# Altium project ST25RU3993_RF_MODULE_REV_E.PrjPcb (part 2 of 4)

## Sheet UHF_RFID_HP.SchDoc
size B; SheetNumber: 4; SheetTotal: 12; PageSetup: Record=PageOptions|CenterHorizontal=True|CenterVertical=True|PrintScale=0.97|XCorrection=1.00|YCorrection=1.00|PrintKind=0|BorderSize=5000000|LeftOffset=0|BottomOffset=0|Orientation=2|PaperLength=1000|PaperWidth=1000|Scale=100|PaperSource=7|PrintQuality=-4|MediaType=1|DitherType=10|PaperKind=A4|PrintScaleMode=1
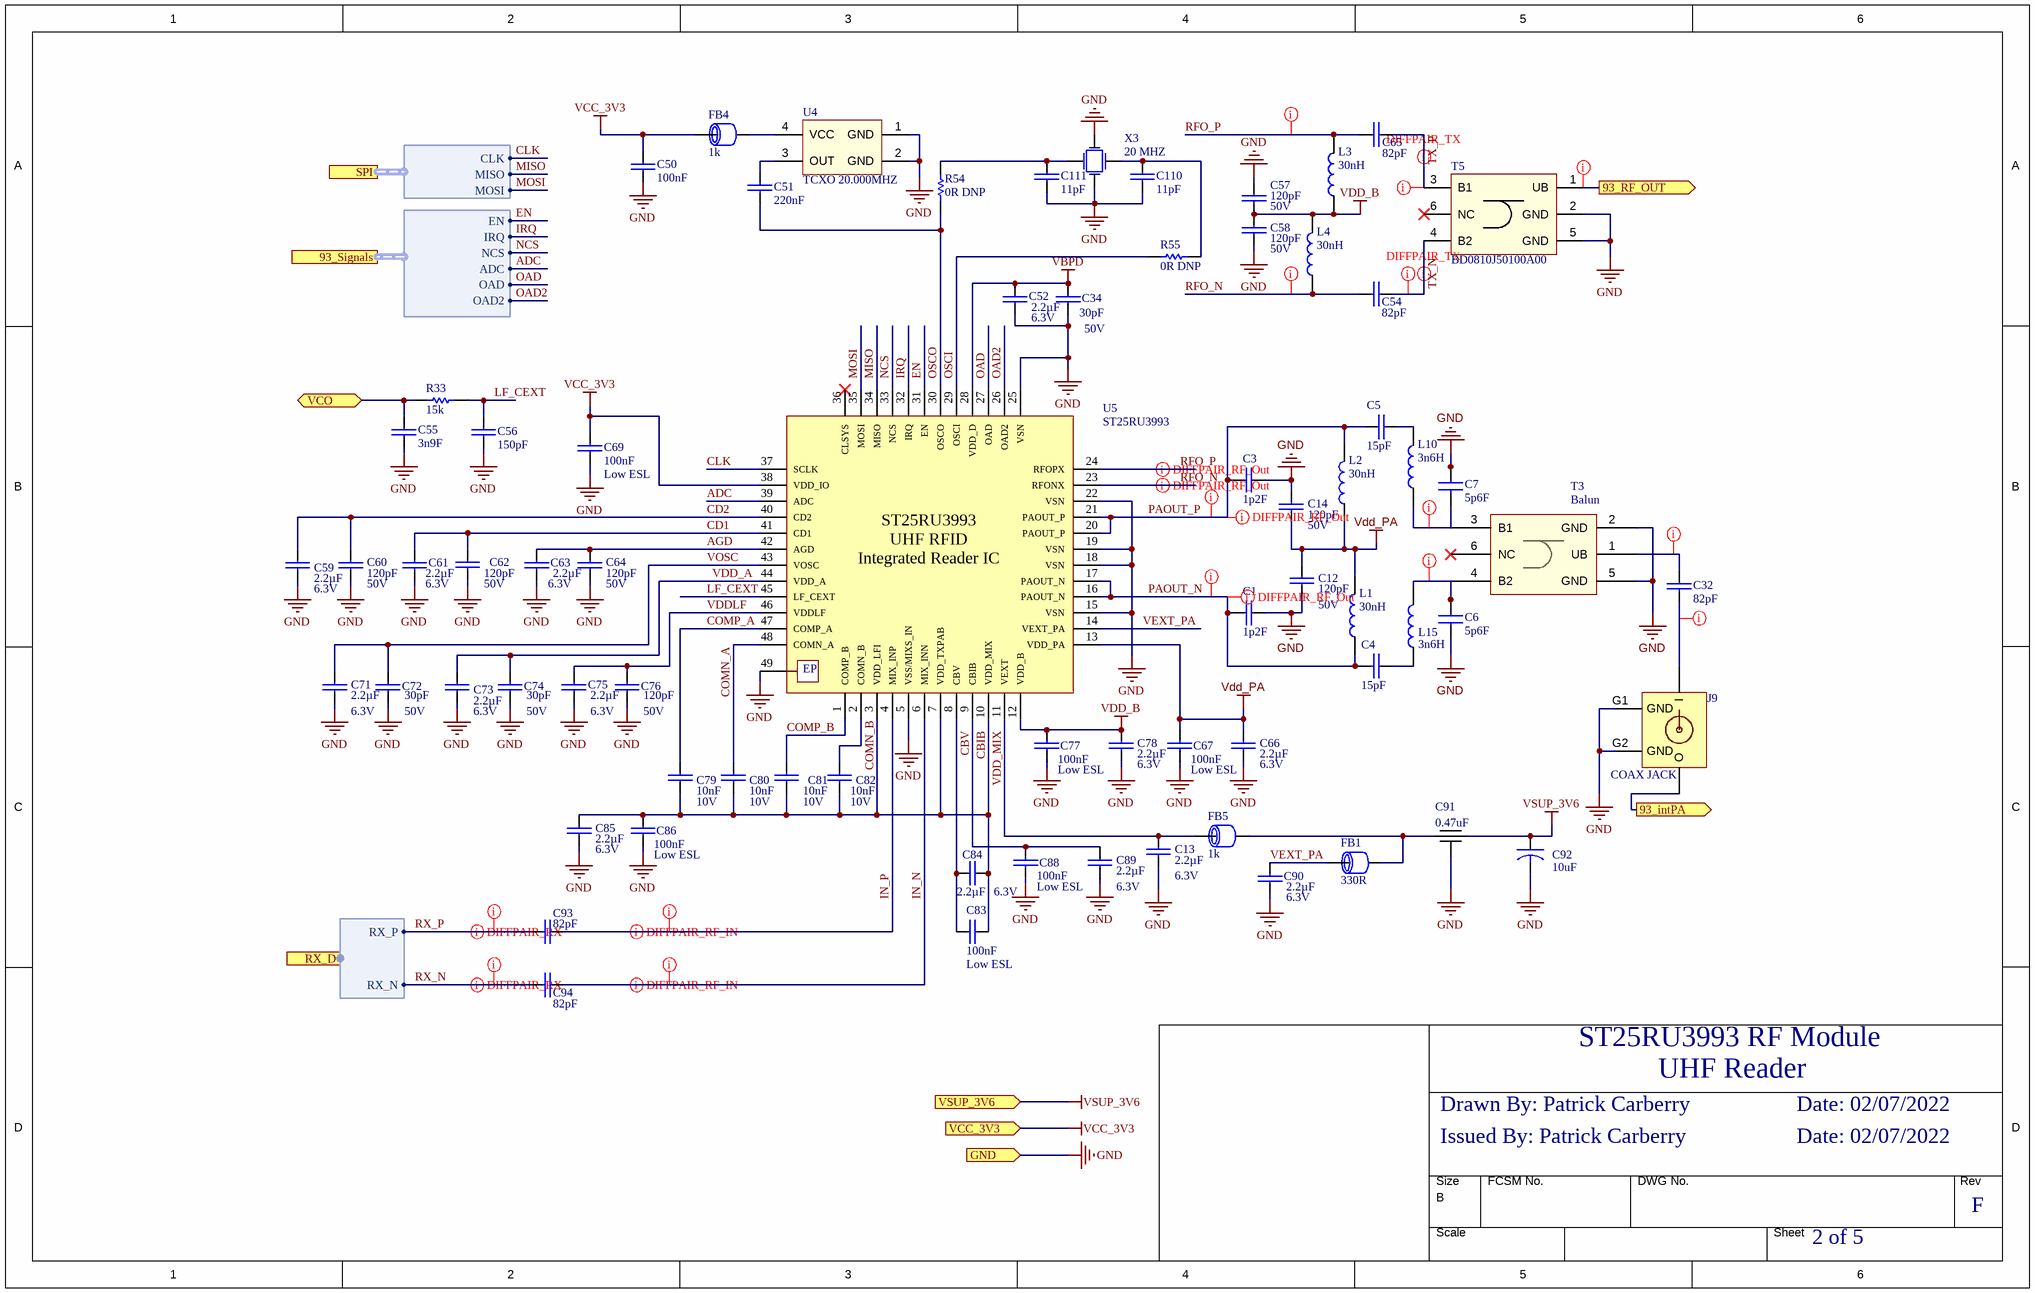
[diagram p1: UHF_RFID_HP.SchDoc]

### Parts
C1  1p2F  [C0402-RF]
C3  1p2F  [C0402-RF]
C4  15pF  [C0402-RF]
C5  15pF  [C0402-RF]
C6  5p6F  [C0402-RF]
C7  5p6F  [C0402-RF]
C12  value 120pF  Voltage: 50V  [C0402-RF]  (hidden comment: C0402C121J5GACAUTO)
C13  Capacitance: 2.2µF  Voltage - Rated: 6.3V  [C0402-RF]  (hidden comment: C0402C225K9PAC7867)
C14  value 120pF  Voltage: 50V  [C0402-RF]  (hidden comment: C0402C121J5GACAUTO)
C32  82pF  [C0402-RF]
C34  value 30pF  Voltage: 50V  [C0402-RF]  (hidden comment: GCM1555C1H300GA16D)
C50  100nF  [C0402-RF]
C51  220nF  [C0402-RF]
C52  Capacitance: 2.2µF  Voltage - Rated: 6.3V  [C0402-RF]  (hidden comment: C0402C225K9PAC7867)
C54  82pF  [C0402-RF]
C55  3n9F  [C0402-RF]
C56  150pF  [C0402-RF]
C57  value 120pF  Voltage: 50V  [C0402-RF]  (hidden comment: C0402C121J5GACAUTO)
C58  value 120pF  Voltage: 50V  [C0402-RF]  (hidden comment: C0402C121J5GACAUTO)
C59  Capacitance: 2.2µF  Voltage - Rated: 6.3V  [C0402-RF]  (hidden comment: C0402C225K9PAC7867)
C60  value 120pF  Voltage: 50V  [C0402-RF]  (hidden comment: C0402C121J5GACAUTO)
C61  Capacitance: 2.2µF  Voltage - Rated: 6.3V  [C0402-RF]  (hidden comment: C0402C225K9PAC7867)
C62  value 120pF  Voltage: 50V  [C0402-RF]  (hidden comment: C0402C121J5GACAUTO)
C63  Capacitance: 2.2µF  Voltage - Rated: 6.3V  [C0402-RF]  (hidden comment: C0402C225K9PAC7867)
C64  value 120pF  Voltage: 50V  [C0402-RF]  (hidden comment: C0402C121J5GACAUTO)
C65  82pF  [C0402-RF]
C66  Capacitance: 2.2µF  Voltage - Rated: 6.3V  [C0402-RF]  (hidden comment: C0402C225K9PAC7867)
C67  100nF  Features: Low ESL  [C0402-LLL]
C69  100nF  Features: Low ESL  [C0402-LLL]
C71  Capacitance: 2.2µF  Voltage - Rated: 6.3V  [C0402-RF]  (hidden comment: C0402C225K9PAC7867)
C72  value 30pF  Voltage: 50V  [C0402-RF]  (hidden comment: GCM1555C1H300GA16D)
C73  Capacitance: 2.2µF  Voltage - Rated: 6.3V  [C0402-RF]  (hidden comment: C0402C225K9PAC7867)
C74  value 30pF  Voltage: 50V  [C0402-RF]  (hidden comment: GCM1555C1H300GA16D)
C75  Capacitance: 2.2µF  Voltage - Rated: 6.3V  [C0402-RF]  (hidden comment: C0402C225K9PAC7867)
C76  value 120pF  Voltage: 50V  [C0402-RF]  (hidden comment: C0402C121J5GACAUTO)
C77  100nF  Features: Low ESL  [C0402-LLL]
C78  Capacitance: 2.2µF  Voltage - Rated: 6.3V  [C0402-RF]  (hidden comment: C0402C225K9PAC7867)
C79  value 10nF  Voltage - Rated: 10V  [C0402-RF]  (hidden comment: CGA2B2X5R1E103K050BA)
C80  value 10nF  Voltage - Rated: 10V  [C0402-RF]  (hidden comment: CGA2B2X5R1E103K050BA)
C81  value 10nF  Voltage - Rated: 10V  [C0402-RF]  (hidden comment: CGA2B2X5R1E103K050BA)
C82  value 10nF  Voltage - Rated: 10V  [C0402-RF]  (hidden comment: CGA2B2X5R1E103K050BA)
C83  100nF  Features: Low ESL  [C0402-LLL]
C84  Capacitance: 2.2µF  Voltage - Rated: 6.3V  [C0402-RF]  (hidden comment: C0402C225K9PAC7867)
C85  Capacitance: 2.2µF  Voltage - Rated: 6.3V  [C0402-RF]  (hidden comment: C0402C225K9PAC7867)
C86  100nF  Features: Low ESL  [C0402-LLL]
C88  100nF  Features: Low ESL  [C0402-LLL]
C89  Capacitance: 2.2µF  Voltage - Rated: 6.3V  [C0402-RF]  (hidden comment: C0402C225K9PAC7867)
C90  Capacitance: 2.2µF  Voltage - Rated: 6.3V  [C0402-RF]  (hidden comment: C0402C225K9PAC7867)
C91  0.47uF  [NFM18PS]
C92  10uF  [2917(7343)]
C93  82pF  [C0402-RF]
C94  82pF  [C0402-RF]
C110  11pF  [C0402-RF]
C111  11pF  [C0402-RF]
FB1  330R  [FB0402-RF]
FB4  1k  [L0402-RF]
FB5  1k  [L0402-RF]
J9  COAX JACK  [MS-156HF]
L1  30nH  [L0402-RF]
L2  30nH  [L0402-RF]
L3  30nH  [L0402-RF]
L4  30nH  [L0402-RF]
L10  3n6H  [L0402-RF]
L15  3n6H  [L0402-RF]
R33  15k  [R0402-RF]
R54  0R DNP  [R0402-RF]
R55  0R DNP  [R0402-RF]
T3  Balun  [JTI-0900BL15C050]
T5  BD0810J50100A00  [BD0810J50100AHF]
U4  TCXO 20.000MHZ  [3.2 x 2.5 mm SMD]
U5  ST25RU3993  [ST25RU3993_QFN48_0.5mm_pitch]
X3  20 MHZ  [NX3225SA]

### Ports
93_intPA (out), 93_RF_OUT (out), 93_Signals (harness Harness_93), GND (in), RX_D (harness Harness_RX_D), SPI (harness Harness_SPI), VCC_3V3 (in), VCO (bidir), VSUP_3V6 (in)

### Harnesses
Harness_RX_D: RX_P, RX_N
Harness_SPI: MISO, MOSI, CLK
Harness_93: IRQ, EN, NCS, ADC, OAD, OAD2

### Nets
GND: C1.2 C3.2 C6.2 C7.1 C12.2 C13.2 C14.1 C34.2 C50.2 C52.1 C55.2 C56.2 C57.1 C58.2 C59.2 C60.2 C61.2 C62.2 C63.2 C64.2 C66.2 C67.2 C69.2 C71.2 C72.2 C73.2 C74.2 C75.2 C76.2 C77.2 C78.2 C85.2 C86.2 C88.2 C89.2 C90.2 C91.2 C92.2 C110.2 C111.2 J9.G1(GND) J9.G2(GND) T3.2(GND) T3.5(GND) T5.2(GND) T5.5(GND) U4.1(GND) U4.2(GND) U5.5(VSS/MIXS_IN) U5.15(VSN) U5.18(VSN) U5.19(VSN) U5.22(VSN) U5.25(VSN) U5.49(EP) X3.2(GND) X3.4(GND) ; port GND
VBPD: C34.1 C52.2 U5.28(VDD_D)
VCC_3V3: C50.1 C69.1 FB4.1 U5.38(VDD_IO) ; port VCC_3V3
VDD_B: C57.2 C58.1 C77.1 C78.1 L3.1 L4.2 U5.12(VDD_B)
Vdd_PA: C12.1 C14.2 C66.1 C67.1 L1.2 L2.1 U5.13(VDD_PA)
VSUP_3V6: C91.3 C92.1 ; port VSUP_3V6
ADC: U5.39(ADC) ; port 93_Signals.ADC
AGD: C63.1 C64.1 U5.42(AGD)
CBIB: C88.1 C89.1 U5.9(CBIB)
CBV: C83.1 C84.1 U5.8(CBV)
CD1: C61.1 C62.1 U5.41(CD1)
CD2: C59.1 C60.1 U5.40(CD2)
CLK: U5.37(SCLK) ; port SPI.CLK
COMN_A: C80.1 U5.48(COMN_A)
COMN_B: C82.1 U5.2(COMN_B)
COMP_A: C79.1 U5.47(COMP_A)
COMP_B: C81.1 U5.1(COMP_B)
EN: U5.31(EN) ; port 93_Signals.EN
IN_N: C94.2 U5.6(MIX_INN)
IN_P: C93.2 U5.4(MIX_INP)
IRQ: U5.32(IRQ) ; port 93_Signals.IRQ
LF_CEXT: C56.1 R33.2 U5.45(LF_CEXT)
MISO: U5.34(MISO) ; port SPI.MISO
MOSI: U5.35(MOSI) ; port SPI.MOSI
NCS: U5.33(NCS) ; port 93_Signals.NCS
OAD: U5.27(OAD) ; port 93_Signals.OAD
OAD2: U5.26(OAD2) ; port 93_Signals.OAD2
OSCI: R55.2 U5.29(OSCI)
OSCO: C51.2 R54.1 U5.30(OSCO)
PAOUT_N: C1.1 C4.1 L1.1 U5.16(PAOUT_N) U5.17(PAOUT_N)
PAOUT_P: C3.1 C5.1 L2.2 U5.20(PAOUT_P) U5.21(PAOUT_P)
RFO_N: C54.1 L4.1 U5.23(RFONX)
RFO_P: C65.1 L3.2 U5.24(RFOPX)
RX_N: C94.1 ; port RX_D.RX_N
RX_P: C93.1 ; port RX_D.RX_P
TX_N: C54.2 T5.4(B2)
TX_P: C65.2 T5.3(B1)
VCO: C55.1 R33.1 ; port VCO
VDD_A: C73.1 C74.1 U5.44(VDD_A)
VDD_MIX: C79.2 C80.2 C81.2 C82.2 C83.2 C84.2 C85.1 C86.1 U5.3(VDD_LFI) U5.7(VDD_TXPAB) U5.10(VDD_MIX)
VDDLF: C75.1 C76.1 U5.46(VDDLF)
VEXT_PA: C90.1 FB1.1 U5.14(VEXT_PA)
VOSC: C71.1 C72.1 U5.43(VOSC)
NetC4_2: C4.2 L15.1
NetC5_2: C5.2 L10.2
NetC6_1: C6.1 L15.2 T3.4(B2)
NetC7_2: C7.2 L10.1 T3.3(B1)
NetC13_1: C13.1 FB5.1 U5.11(VEXT)
NetC32_1: C32.1 J9.IN(I)
NetC32_2: C32.2 T3.1(UB)
NetC51_1: C51.1 U4.3(OUT)
NetC91_1: C91.1 FB1.2 FB5.2
NetC107_1: J9.OUT(O) ; port 93_intPA
NetC110_1: C110.1 R55.1 X3.3
NetC111_1: C111.1 R54.2 X3.1
NetFB4_2: FB4.2 U4.4(VCC)
NetJ1_IN: T5.1(UB) ; port 93_RF_OUT

Not connected (* = marked no-connect by the designer): T3 6(NC)*; T5 6(NC)*; U5 36(CLSYS)*

### Layout directives
net class SE_CPWG: NetC32_1, NetC32_2, NetJ1_IN
differential pair: IN_N, IN_P, PAOUT_N, PAOUT_P, RFO_N, RFO_P, RX_N, RX_P, TX_N, TX_P
net class Differential_RF: IN_N, IN_P, RFO_N, RFO_P, RX_N, RX_P, TX_N, TX_P
net class PAOUT: NetC6_1, NetC7_2, PAOUT_N, PAOUT_P

### Notes on the sheet
- Drawn By: Patrick Carberry
- ST25RU3993 RF Module
- UHF Reader
- Date: 02/07/2022
- Issued By: Patrick Carberry
- 2 of 5
- F
- (in symbol ST25RU3993) ST25RU3993 / UHF RFID / Integrated Reader IC

### Library data of the parts
C1 C3 = GRM1555C1H1R2WA01D: CAP CER 1.2PF 50V NP0 0402; Manufacturer: Murata Electronics North America; Tolerance: ±0.05pF; Temperature Coefficient: C0G, NP0; Exact Component Match: yes; Supplier 1: Digi-Key; Supplier Part Number 1: 490-6210-1-ND; Manufacturer Part Number: GRM1555C1H1R2WA01D; RoHS: RoHS Compliant; Category: Capacitors; Stock 1: 22733; Pricing 1: 1=0.1, 10=0.036, 50=0.02, 100=0.0169, 250=0.01384, 500=0.01182, 1000=0.00921, 5000=0.00768 (EUR); Packaging: Cut Tape (CT); Part Status: Active; Capacitance: 1.2pF; Voltage - Rated: 50V; Operating Temperature: -55°C ~ 125°C; Features: -; Ratings: -; Applications: General Purpose; Mounting Type: Surface Mount, MLCC; Package / Case: 0402 (1005 Metric); Size / Dimension: 0.039" L x 0.020" W (1.00mm x 0.50mm); Height - Seated (Max): -; Thickness (Max): 0.022" (0.55mm); Lead Spacing: -; Lead Style: -; ComponentLink1URL: http://www.murata.com/~/media/webrenewal/support/library/catalog/products/capacitor/mlcc/c02e.pdf; ComponentLink1Description: http://www.murata.com/~/media/webrenewal/support/library/catalog/products/capacitor/mlcc/c02e.pdf
C4 C5 = GRM1555C1H150GA01D: CAP CER 15PF 50V NP0 0402; Manufacturer: Murata Electronics North America; Tolerance: ±2%; Temperature Coefficient: C0G, NP0; Exact Component Match: yes; Supplier 1: Digi-Key; Supplier Part Number 1: 490-6201-1-ND; Manufacturer Part Number: GRM1555C1H150GA01D; RoHS: RoHS Compliant; Category: Capacitors; Stock 1: 104870; Pricing 1: 1=0.1, 10=0.021, 50=0.0114, 100=0.0095, 250=0.0078, 500=0.00666, 1000=0.00518, 5000=0.00432 (EUR); Packaging: Cut Tape (CT); Part Status: Active; Capacitance: 15pF; Voltage - Rated: 50V; Operating Temperature: -55°C ~ 125°C; Features: -; Ratings: -; Applications: General Purpose; Mounting Type: Surface Mount, MLCC; Package / Case: 0402 (1005 Metric); Size / Dimension: 0.039" L x 0.020" W (1.00mm x 0.50mm); Height - Seated (Max): -; Thickness (Max): 0.022" (0.55mm); Lead Spacing: -; Lead Style: -; ComponentLink1URL: http://www.murata.com/~/media/webrenewal/support/library/catalog/products/capacitor/mlcc/c02e.pdf; ComponentLink1Description: http://www.murata.com/~/media/webrenewal/support/library/catalog/products/capacitor/mlcc/c02e.pdf
C6 C7 = GJM1555C1H5R6CB01D: CAP CER 5.6PF 50V NP0 0402; Manufacturer 1: Murata Electronics North America; Tolerance: ±0.25pF; Temperature Coefficient: C0G, NP0; Frequency Min: 380; Frequency Max: 960; Gain: 32; RF IC Case Style: QFN; No. of Pins: 16; Supply Voltage Min: 3; Supply Voltage Max: 5; Frequency Range: 380MHz to 960; RF Type: General Purpose; Supply Current: 320; Supply Voltage Range: 3V to 5V<!--FANDB--><div class="features-and-benefits-container"><div class="features-and-benefits-description"><span class="features-benefits-value">The RFPA0133 is a 3 to 5V high efficiency programmable gain Power Amplifier designed to offer saturated efficiency greater than 60% over a range of frequencies from 380 to 960MHz. The device is manufactured on an advanced Gallium Arsenide Heterojunction Bipolar Transistor (HBT) process.</span></div><div class="features-and-benefits-list"><ul class="features-and-benefits-list-list"><li class="features-and-benefits-list-item">0.5W CW Output power at 3.6V</li><li class="features-and-benefits-list-item">1W CW Output power at 5V</li><li class="features-and-benefits-list-item">32dB Small signal gain at 900; Exact Component Match: yes; Supplier 1: Digi-Key; Supplier Part Number 1: 490-3103-1-ND; Manufacturer Part Number 1: GJM1555C1H5R6CB01D; RoHS: RoHS Compliant; Category: Capacitors; Stock 1: 38361; Pricing 1: 1=0.09, 10=0.054, 50=0.0294, 100=0.0248, 250=0.02028, 500=0.01734, 1000=0.0135, 5000=0.01125 (EUR); Packaging: Cut Tape (CT); Part Status: Active; Capacitance: 5.6pF; Voltage - Rated: 50V; Operating Temperature: -55°C ~ 125°C; Features: High Q, Low Loss; Ratings: -; Applications: RF, Microwave, High Frequency; Failure Rate: *; Mounting Type: Surface Mount, MLCC; Package / Case: 0402 (1005 Metric); Size / Dimension: 0.039" L x 0.020" W (1.00mm x 0.50mm); Height - Seated (Max): -; Thickness (Max): 0.022" (0.55mm); Lead Spacing: -; Lead Style: -; ComponentLink1URL: http://www.murata.com/~/media/webrenewal/support/library/catalog/products/capacitor/mlcc/c02e.pdf; ComponentLink1Description: http://www.murata.com/~/media/webrenewal/support/library/catalog/products/capacitor/mlcc/c02e.pdf; Supplier 2: Farnell; Supplier Part Number 2: 2066376; Manufacturer 2: RFMD; Manufacturer Part Number 2: RFPA0133; Stock 2: 0; Pricing 2: 1=26.04, 10=22.77, 100=18.87, 200=16.98, 500=15.29, 1000=12.85, 2000=11.58 (GBP); Noise Figure Typ: -; Operating Temperature Min: -40; Operating Temperature Max: 85; Product Range: -; Automotive Qualification Standard: -; MSL: MSL 3 - 168 hours; Operating Temperature Range: -40°C to +85; ComponentLink2URL: http://www.farnell.com/datasheets/1848789.pdf; ComponentLink2Description: http://www.farnell.com/datasheets/1848789.pdf; ComponentLink3URL: http://www.farnell.com/datasheets/2042598.pdf; ComponentLink3Description: http://www.farnell.com/datasheets/2042598.pdf; Manufacturer: Murata Electronics North America; Manufacturer Part Number: GJM1555C1H5R6CB01D
C12 C14 C57 C58 C60 C62 C64 C76 = CAP_120PF_50V_5%_C0G_0402: CAP CER 120PF 50V C0G/NP0 0402; Manufacturer: KEMET; Manufacturer Part Number: C0402C121J5GACAUTO; ComponentLink1URL: https://content.kemet.com/datasheets/KEM_C1022_C0G_AUTO_SMD.pdf; ComponentLink1Description: http://search.murata.co.jp/Ceramy/image/img/A01X/G101/ENG/GRM0335C1H121JA01-01.pdf
C13 C52 C59 C61 C63 C66 C71 C73 C75 C78 C84 C85 C89 C90 = CAP_2.2UF_6.3V_10%_X5R_0402: Manufacturer: KEMET; Tolerance: 10%; Temperature Coefficient: X5R; Thickness (Max): 0.014" (0.35mm); ComponentLink1URL: https://connect.kemet.com:7667/gateway/IntelliData-ComponentDocumentation/1.0/download/datasheet/C0402C225K9PACTU; ComponentLink1Description: http://www.murata.com/~/media/webrenewal/support/library/catalog/products/capacitor/mlcc/c02e.pdf; Manufacturer Part Number: C0402C225K9PAC7867
C32 C54 C65 C93 C94 = GRM1555C1H820GA01J: CAP CER 82PF 50V C0G/NP0 0402; Manufacturer: Murata Electronics North America; Tolerance: ±2%; Temperature Coefficient: C0G, NP0; Filter Type: Signal Line; Number of Lines: 1; Impedance @ Frequency: 1 kOhm @ 100MHz; Current Rating (Max): 250mA; DC Resistance (DCR) (Max): 1.1 Ohm; Type: Zener; Voltage - Reverse Standoff (Typ): 3V; Voltage - Breakdown (Min): 6V; Voltage - Clamping (Max) @ Ipp: 17V; Current - Peak Pulse (10/1000µs): 1A (8/20µs); Power - Peak Pulse: 40W; Power Line Protection: No; Capacitance @ Frequency: 0.4pF @ 200MHz ~ 3GHz; Supplier 1: Digi-Key; Supplier Part Number 1: 490-7760-1-ND; Manufacturer Part Number: GRM1555C1H820GA01J; RoHS: RoHS Compliant; Category: Capacitors; Stock: 52112; Pricing: 1=0.08, 10=0.042, 100=0.0189, 500=0.01352, 1000=0.01063, 2500=0.00966, 5000=0.00889 (EUR); Packaging: Cut Tape (CT); Part Status: Active; Voltage - Rated: 50V; Operating Temperature: -55°C ~ 125°C; Features: -; Ratings: -; Applications: General Purpose; Mounting Type: Surface Mount, MLCC; Package / Case: 0402 (1005 Metric); Size / Dimension: 0.039" L x 0.020" W (1.00mm x 0.50mm); Height - Seated (Max): -; Thickness (Max): 0.022" (0.55mm); Lead Spacing: -; Lead Style: -; ComponentLink1URL: http://www.murata.com/~/media/webrenewal/support/library/catalog/products/capacitor/mlcc/c02e.ashx; ComponentLink1Description: http://www.murata.com/~/media/webrenewal/support/library/catalog/products/capacitor/mlcc/c02e.ashx; Supplier 2: Digi-Key; Supplier Part Number 2: 490-3999-1-ND; Height (Max): 0.022" (0.55mm); ComponentLink2URL: http://www.murata.com/en-global/products/productdata/8796740223006/ENFA0024.pdf; ComponentLink2Description: http://www.murata.com/en-global/products/productdata/8796740223006/ENFA0024.pdf; Supplier 3: Digi-Key; Supplier Part Number 3: 497-13413-1-ND; Supplier Device Package: SOD-882T; ComponentLink3URL: http://www.st.com/content/ccc/resource/technical/document/datasheet/e8/d2/ed/fd/e8/00/4a/29/DM00065056.pdf/files/DM00065056.pdf/jcr:content/translations/en.DM00065056.pdf; ComponentLink3Description: http://www.st.com/content/ccc/resource/technical/document/datasheet/e8/d2/ed/fd/e8/00/4a/29/DM00065056.pdf/files/DM00065056.pdf/jcr:content/translations/en.DM00065056.pdf; Exact Component Match: no
C34 C72 C74 = CAP_30PF_50V_2%_C0G_0402: Manufacturer: Murata Electronics North America; Manufacturer Part Number: GCM1555C1H300GA16D; ComponentLink1URL: https://search.murata.co.jp/Ceramy/image/img/A01X/G101/ENG/GCM1555C1H300GA16-01.pdf; ComponentLink1Description: http://search.murata.co.jp/Ceramy/image/img/A01X/G101/ENG/GRM0335C1H300GA01-01.pdf
C50 = GRM155R71C104KA88D: CAP CER 0.1UF 16V X7R 0402; Manufacturer: Murata Electronics North America; Capacitance: 0.10µF; Tolerance: ±10%; Exact Component Match: no; Supplier 1: Digi-Key; Supplier Part Number 1: 490-3261-1-ND; Manufacturer Part Number: GRM155R71C104KA88D; RoHS: RoHS Compliant; Category: Capacitors; Stock 1: 20025332; Pricing 1: 1=0.16, 10=0.019, 50=0.0104, 100=0.0087, 250=0.00716, 500=0.00612, 1000=0.00475, 5000=0.00396 (EUR); Packaging: Cut Tape (CT); Part Status: Active; Voltage - Rated: 16V; Temperature Coefficient: X7R; Operating Temperature: -55°C ~ 125°C; Features: -; Ratings: -; Applications: General Purpose; Failure Rate: *; Mounting Type: Surface Mount, MLCC; Package / Case: 0402 (1005 Metric); Size / Dimension: 0.039" L x 0.020" W (1.00mm x 0.50mm); Height - Seated (Max): -; Thickness (Max): 0.022" (0.55mm); Lead Spacing: -; Lead Style: -; ComponentLink1URL: http://www.murata.com/~/media/webrenewal/support/library/catalog/products/capacitor/mlcc/c02e.pdf; ComponentLink1Description: http://www.murata.com/~/media/webrenewal/support/library/catalog/products/capacitor/mlcc/c02e.pdf; Manufacturer 1: Murata Electronics North America; Manufacturer Part Number 1: GRM155R71C104KA88D
C51 = GRM155R6YA224KE01D: CAP CER 0.22UF 35V X5R 0402; Manufacturer: Murata Electronics North America; Tolerance: ±10%; Exact Component Match: no; Supplier 1: Digi-Key; Supplier Part Number 1: 490-10460-1-ND; Manufacturer Part Number: GRM155R6YA224KE01D; RoHS: RoHS Compliant; Category: Capacitors; Stock: 125509; Pricing: 1=0.08, 10=0.044, 100=0.0195, 500=0.01392, 1000=0.01094, 2500=0.00994, 5000=0.00915 (EUR); Packaging: Cut Tape (CT); Part Status: Active; Voltage - Rated: 35V; Temperature Coefficient: X5R; Operating Temperature: -55°C ~ 85°C; Features: Derating Recommended; Ratings: -; Applications: General Purpose; Mounting Type: Surface Mount, MLCC; Package / Case: 0402 (1005 Metric); Size / Dimension: 0.039" L x 0.020" W (1.00mm x 0.50mm); Height - Seated (Max): -; Thickness (Max): 0.022" (0.55mm); Lead Spacing: -; Lead Style: -; ComponentLink1URL: http://search.murata.co.jp/Ceramy/image/img/A01X/G101/ENG/GRM155R6YA224KE01-01.pdf; ComponentLink1Description: http://search.murata.co.jp/Ceramy/image/img/A01X/G101/ENG/GRM155R6YA224KE01-01.pdf
C55 = GRM1557U1A392JA01D: CAP CER 3900PF 10V U2J 0402; Manufacturer: Murata Electronics North America; Tolerance: ±5%; Exact Component Match: no; Supplier 1: Digi-Key; Supplier Part Number 1: 490-10691-1-ND; Manufacturer Part Number: GRM1557U1A392JA01D; RoHS: RoHS Compliant; Category: Capacitors; Stock 1: 27875; Pricing 1: 1=0.18, 10=0.122, 50=0.0704, 100=0.0582, 250=0.04896, 500=0.04102, 1000=0.03367, 5000=0.02846 (EUR); Packaging: Cut Tape (CT); Part Status: Active; Capacitance: 3900pF; Voltage - Rated: 10V; Temperature Coefficient: U2J; Operating Temperature: -55°C ~ 125°C; Features: -; Ratings: -; Applications: General Purpose; Failure Rate: *; Mounting Type: Surface Mount, MLCC; Package / Case: 0402 (1005 Metric); Size / Dimension: 0.039" L x 0.020" W (1.00mm x 0.50mm); Height - Seated (Max): -; Thickness (Max): 0.022" (0.55mm); Lead Spacing: -; Lead Style: -; ComponentLink1URL: http://www.murata.com/~/media/webrenewal/support/library/catalog/products/capacitor/mlcc/c02e.pdf; ComponentLink1Description: http://www.murata.com/~/media/webrenewal/support/library/catalog/products/capacitor/mlcc/c02e.pdf; Manufacturer 1: Murata Electronics North America; Manufacturer Part Number 1: GRM1557U1A392JA01D
C56 = GRM1555C1H151FA01D: CAP CER 150PF 50V NP0 0402; Manufacturer: Murata Electronics North America; Tolerance: ±1%; Temperature Coefficient: C0G, NP0; Notification: Current market demand for these product types have resulted in fluctuating and extending lead times. Lead times may differ.; Exact Component Match: no; Supplier 1: Digi-Key; Supplier Part Number 1: 490-8185-1-ND; Manufacturer Part Number: GRM1555C1H151FA01D; RoHS: RoHS Compliant; Category: Capacitors; Stock: 0; Pricing: 1=0.09, 10=0.068, 100=0.0318, 500=0.0223, 1000=0.01845, 2500=0.01718, 5000=0.01572 (EUR); Packaging: Cut Tape (CT); Part Status: Active; Voltage - Rated: 50V; Operating Temperature: -55°C ~ 125°C; Features: -; Ratings: -; Applications: General Purpose; Mounting Type: Surface Mount, MLCC; Package / Case: 0402 (1005 Metric); Size / Dimension: 0.039" L x 0.020" W (1.00mm x 0.50mm); Height - Seated (Max): -; Thickness (Max): 0.022" (0.55mm); Lead Spacing: -; Lead Style: -; ComponentLink1URL: http://search.murata.co.jp/Ceramy/image/img/A01X/G101/ENG/GRM1555C1H151FA01-01.pdf; ComponentLink1Description: http://search.murata.co.jp/Ceramy/image/img/A01X/G101/ENG/GRM1555C1H151FA01-01.pdf
C67 C69 C77 C83 C86 C88 = LLL153C80J104ME01E: CAP CER 0.1UF 6.3V X6S 0204; Manufacturer: Murata Electronics North America; Tolerance: ±20%; Type: Steering (Rail to Rail); Voltage - Reverse Standoff (Typ): 5.25V; Voltage - Breakdown (Min): 6V; Power - Peak Pulse: 500W; Power Line Protection: Yes; Exact Component Match: no; Supplier 1: Digi-Key; RoHS: RoHS Compliant; Category: Capacitors; Stock: 1389; Pricing 1: 1=0.19, 10=0.133, 100=0.0671, 500=0.0459, 1000=0.04061, 2500=0.03884, 5000=0.03531 (EUR); Packaging: Cut Tape (CT); Part Status: Active; Voltage - Rated: 6.3V; Temperature Coefficient: X6S; Operating Temperature: -55°C ~ 105°C; Ratings: -; Applications: Bypass, Decoupling; Mounting Type: Surface Mount, MLCC; Package / Case: 0204 (0510 Metric); Size / Dimension: 0.020" L x 0.039" W (0.50mm x 1.00mm); Height - Seated (Max): -; Thickness (Max): 0.014" (0.35mm); Lead Spacing: -; Lead Style: -; ComponentLink1URL: http://www.murata.com/~/media/webrenewal/support/library/catalog/products/capacitor/mlcc/c02e.ashx; ComponentLink1Description: http://www.murata.com/~/media/webrenewal/support/library/catalog/products/capacitor/mlcc/c02e.ashx; Supplier Part Number 1: 490-4310-1-ND; Manufacturer Part Number: LLL153C80J104ME01E; Supplier 2: Digi-Key; Pricing 2: 1=0.97, 10=0.867, 100=0.6756, 500=0.55814, 1000=0.44063 (EUR); Voltage - Clamping (Max) @ Ipp: -; Current - Peak Pulse (10/1000µs): -; Capacitance @ Frequency: -; Supplier Device Package: 8-SO; ComponentLink2URL: http://www.st.com/content/ccc/resource/technical/document/datasheet/3e/ec/b2/54/b2/76/47/90/CD00001361.pdf/files/CD00001361.pdf/jcr:content/translations/en.CD00001361.pdf; ComponentLink2Description: http://www.st.com/content/ccc/resource/technical/document/datasheet/3e/ec/b2/54/b2/76/47/90/CD00001361.pdf/files/CD00001361.pdf/jcr:content/translations/en.CD00001361.pdf; Supplier Part Number 2: 497-3281-1-ND
C79-C82 = CAP_10NF_25V_10%_0402: CAP CER 10000PF 25V X5R 0402; Manufacturer: TDK Corporation; ComponentLink1URL: https://product.tdk.com/system/files/dam/doc/product/capacitor/ceramic/mlcc/catalog/mlcc_automotive_general_en.pdf; ComponentLink1Description: Datasheet; Manufacturer Part Number: CGA2B2X5R1E103K050BA
C91 = NFM18PS474R0J3D: CAP FEEDTHRU 0.47UF 6.3V 0603; Manufacturer: Murata Electronics North America; Capacitance: 0.47µF; Tolerance: ±20%; Current: 2A; DC Resistance (DCR) (Max): 30 mOhm; Type: Polymer; ESR (Equivalent Series Resistance): 70 mOhm; Lifetime @ Temp.: 1000 Hrs @ 105°C; Ripple Current - High Frequency: 1A @ 100kHz; Surface Mount Land Size: 0.287" L x 0.169" W (7.30mm x 4.30mm); Exact Component Match: no; Supplier 1: Digi-Key; Manufacturer Part Number: NFM18PS474R0J3D; RoHS: RoHS Compliant; Category: Filters; Stock: 926; Pricing 1: 1=0.14, 10=0.132, 25=0.1264, 50=0.122, 100=0.1181, 250=0.11192, 500=0.09362, 1000=0.07267 (EUR); Packaging: Cut Tape (CT); Part Status: Active; Voltage - Rated: 6.3V; Operating Temperature: -55°C ~ 125°C; Insertion Loss: -; Temperature Coefficient: -; Ratings: -; Mounting Type: Surface Mount; Package / Case: 0603 (1608 Metric), 3 PC Pad; Size / Dimension: 0.063" L x 0.031" W (1.60mm x 0.80mm); Height (Max): 0.028" (0.70mm); Thread Size: -; ComponentLink1URL: http://search.murata.co.jp/Ceramy/image/img/A01X/G101/ENG/NFM18PS474R0J3-01.pdf; ComponentLink1Description: http://search.murata.co.jp/Ceramy/image/img/A01X/G101/ENG/NFM18PS474R0J3-01.pdf; Supplier Part Number 1: 490-6975-1-ND; Supplier 2: Digi-Key; Pricing 2: 1=1.25, 10=0.984, 100=0.7379, 500=0.55756, 1000=0.49196 (EUR); Applications: General Purpose; Ripple Current - Low Frequency: -; Lead Spacing: -; Height - Seated (Max): 0.075" (1.90mm); ComponentLink2URL: http://www.murata.com/~/media/webrenewal/support/library/catalog/products/capacitor/polymer/c90e.ashx; ComponentLink2Description: http://www.murata.com/~/media/webrenewal/support/library/catalog/products/capacitor/polymer/c90e.ashx; Supplier Part Number 2: 490-5481-1-ND
C92 = ECASD41C106M060K00: CAP POLYMER 10UF 20% 16V SMD; Manufacturer: Murata; Product Training Modules: Polymer Aluminum Electrolytic Capacitors Using Murata's Polymer Aluminum Capacitors to Replace Tantalum; Catalog Drawings: ECAS Series End_D4 ECAS Series Side; Featured Product: ECAS Series Polymer Aluminum Electrolytic Capacitors; EDA / CAD Models: Download from Accelerated Designs; Capacitance: 10µF; ESR (Equivalent Series Resistance): 60 mOhm @ 100kHz; Lifetime @ Temp.: 1000 Hrs @ 105°C; Polarization: Polar; Ripple Current: 1A; Surface Mount Land Size: 0.287" L x 0.169" W (7.30mm x 4.30mm); Online Catalog: ECAS Series; Other Names: 490-5482-2; Supplier 2: Distrelec; Manufacturer Part Number: ECASD41C106M060K00; Stock: 2288; Pricing 1: 1=0.51, 50=0.46, 250=0.41 (EUR); Standard Package: 3,000; Category: Capacitors; Family: Aluminum - Polymer Capacitors; Series: ECAS; Packaging: Tape & Reel (TR); Tolerance: ±20%; Voltage Rating: 16V; Operating Temperature: -40°C ~ 105°C; Applications: General Purpose; Size / Dimension: 0.287" L x 0.169" W (7.30mm x 4.30mm); Height - Seated (Max): 0.075" (1.90mm); Mounting Type: Surface Mount; Package / Case: 2917 (7343 Metric); ComponentLink1URL: https://datasheet.ciiva.com/93/c90e-93987.pdf; ComponentLink1Description: https://datasheet.ciiva.com/93/c90e-93987.pdf; ComponentLink2URL: https://datasheet.ciiva.com/26889/getdatasheetpartid-716590-26889066.pdf; ComponentLink2Description: https://datasheet.ciiva.com/26889/getdatasheetpartid-716590-26889066.pdf; ComponentLink3URL: https://datasheet.ciiva.com/93/c90e-93985.pdf; ComponentLink3Description: https://datasheet.ciiva.com/93/c90e-93985.pdf; ComponentLink4URL: https://datasheet.ciiva.com/93/c90e-93986.pdf; ComponentLink4Description: https://datasheet.ciiva.com/93/c90e-93986.pdf; ComponentLink5URL: https://datasheet.ciiva.com/14113/ecas-eng-ds-14113434.pdf; ComponentLink5Description: https://datasheet.ciiva.com/14113/ecas-eng-ds-14113434.pdf; Supplier Part Number 2: 16705082; Supplier 1: Digi-Key; Supplier Part Number 1: 490-5482-1-ND
C110 C111 = GJM1555C1H110GB01D (2): CAP CER 11PF 50V C0G/NP0 0402; Manufacturer: Murata Electronics North America; Tolerance: ±2%; Temperature Coefficient: C0G, NP0; Exact Component Match: no; Supplier 1: Digi-Key; Supplier Part Number 1: 490-6072-1-ND; Manufacturer Part Number: GJM1555C1H110GB01D; RoHS: RoHS Compliant; Category: Capacitors; Stock: 28598; Pricing: 1=0.16, 10=0.11, 100=0.0559, 500=0.03826, 1000=0.03384, 2500=0.03237, 5000=0.02943 (EUR); Packaging: Cut Tape (CT); Part Status: Active; Voltage - Rated: 50V; Operating Temperature: -55°C ~ 125°C; Features: High Q, Low Loss; Ratings: -; Applications: RF, Microwave, High Frequency; Mounting Type: Surface Mount, MLCC; Package / Case: 0402 (1005 Metric); Size / Dimension: 0.039" L x 0.020" W (1.00mm x 0.50mm); Height - Seated (Max): -; Thickness (Max): 0.022" (0.55mm); Lead Spacing: -; Lead Style: -; ComponentLink1URL: http://search.murata.co.jp/Ceramy/image/img/A01X/G101/ENG/GJM1555C1H110GB01-01.pdf; ComponentLink1Description: http://search.murata.co.jp/Ceramy/image/img/A01X/G101/ENG/GJM1555C1H110GB01-01.pdf
FB1 = BLM15PX331SN1D: FERRITE BEAD 330 OHM 0402 1LN; Manufacturer: Murata Electronics North America; Filter Type: Power Line; Current Rating (Max): 1.2A; DC Resistance (DCR) (Max): 150 mOhm; Exact Component Match: no; Supplier 1: Digi-Key; Supplier Part Number 1: 490-11022-1-ND; Manufacturer Part Number: BLM15PX331SN1D; RoHS: RoHS Compliant; Category: Filters; Stock: 29501; Pricing: 1=0.13, 10=0.103, 25=0.08, 50=0.0662, 100=0.0571, 250=0.04568, 500=0.0411, 1000=0.03425, 5000=0.03196 (EUR); Packaging: Cut Tape (CT); Part Status: Active; Ratings: -; Operating Temperature: -55°C ~ 125°C; Package / Case: 0402 (1005 Metric); Mounting Type: Surface Mount; Height (Max): 0.022" (0.55mm); Size / Dimension: 0.039" L x 0.020" W (1.00mm x 0.50mm); ComponentLink1URL: https://www.murata.com/en-us/products/productdata/8796740059166/ENFA0018.pdf; ComponentLink1Description: https://www.murata.com/en-us/products/productdata/8796740059166/ENFA0018.pdf
FB4 FB5 = BLM15HG102SN1D: FERRITE BEAD 1 KOHM 0402 1LN; Manufacturer: Murata Electronics North America; Filter Type: Signal Line; Number of Lines: 1; Impedance @ Frequency: 1 kOhm @ 100MHz; Current Rating (Max): 250mA; DC Resistance (DCR) (Max): 1.1 Ohm; Exact Component Match: no; Supplier 1: Digi-Key; Supplier Part Number 1: 490-3999-1-ND; Manufacturer Part Number: BLM15HG102SN1D; RoHS: RoHS Compliant; Category: Filters; Stock: 335865; Pricing: 1=0.16, 10=0.123, 25=0.102, 50=0.088, 100=0.0792, 250=0.06688, 500=0.05984, 1000=0.05104, 5000=0.04752 (EUR); Packaging: Cut Tape (CT); Part Status: Active; Ratings: -; Operating Temperature: -55°C ~ 125°C; Package / Case: 0402 (1005 Metric); Mounting Type: Surface Mount; Height (Max): 0.022" (0.55mm); Size / Dimension: 0.039" L x 0.020" W (1.00mm x 0.50mm); ComponentLink1URL: http://www.murata.com/en-global/products/productdata/8796740223006/ENFA0024.pdf; ComponentLink1Description: http://www.murata.com/en-global/products/productdata/8796740223006/ENFA0024.pdf
J9 = MS-156HF: CONN COAX JACK STR 50 OHM SMD; Manufacturer 1: Hirose Electric Co Ltd; Manufacturer Part Number 1: MS-156HF(01); Connector Style: Coaxial Switch - 4mm Plug Dia; Connector Type: Receptacle, Female Socket; Contact Termination: Solder; Impedance: 50 Ohm; Frequency - Max: 6GHz; Body Material: Phosphor Bronze; Body Finish: Gold; Center Contact Material: Beryllium Copper; Dielectric Material: Polyamide (PA), Nylon 6T; Coupler Type: Standard; Frequency: 700MHz ~ 1GHz; Coupling Factor: 10.9dB; Insertion Loss: 0.21dB; Power - Max: 2W; Return Loss: 17.5dB; Exact Component Match: no; Supplier 1: Digi-Key; Supplier Part Number 1: H11669-ND; RoHS: RoHS Compliant; Category: Connectors, Interconnects; Stock 1: 10; Pricing 1: 1=0.84, 10=0.735, 25=0.6912, 50=0.6626, 100=0.6337, 250=0.57612, 500=0.51852, 1000=0.4609, 2500=0.41769 (EUR); Packaging: Bulk; Part Status: Active; Shield Termination: Solder; Mounting Type: Surface Mount; Cable Group: -; Fastening Type: Snap-On; Features: Internal Switch; Housing Color: Gold; Ingress Protection: -; Center Contact Plating: Gold; Voltage Rating: -; Operating Temperature: -40°C ~ 85°C; ComponentLink1URL: https://www.hirose.com/product/en/download_file/key_name/MS-156HF/category/Catalog/doc_file_id/49714/?file_category_id=4&item_id=394&is_series=1; ComponentLink1Description: https://www.hirose.com/product/en/download_file/key_name/MS-156HF/category/Catalog/doc_file_id/49714/?file_category_id=4&item_id=394&is_series=1; Supplier 2: Digi-Key; Supplier Part Number 2: 1173-1084-1-ND; Manufacturer 2: Anaren; Manufacturer Part Number 2: DC0710J5010AHF; Stock 2: 8788; Pricing 2: 1=0.82, 10=0.735, 25=0.648, 100=0.5833, 250=0.50772, 500=0.4537 (EUR); Applications: General Purpose; Isolation: -; Package / Case: 0805 (2012 Metric); Supplier Device Package: 0805; ComponentLink2URL: https://www.anaren.com/sites/default/files/Part-Datasheets/DC0710J5010AHF_Datasheet_RevA.pdf; ComponentLink2Description: https://www.anaren.com/sites/default/files/Part-Datasheets/DC0710J5010AHF_Datasheet_RevA.pdf; Manufacturer: Hirose Electric Co Ltd; Manufacturer Part Number: MS-156HF(01)
L1 L2 = LQW15AN30NG00D: FIXED IND 30NH 270MA 580 MOHM; Manufacturer: Murata Electronics North America; Type: Wirewound; Material - Core: Non-Magnetic; Tolerance: ±2%; Shielding: Unshielded; DC Resistance (DCR): 580 mOhm Max; Q @ Freq: 25 @ 250MHz; Frequency - Self Resonant: 3.3GHz; Frequency - Test: 100MHz; Exact Component Match: yes; Supplier 1: Digi-Key; Supplier Part Number 1: 490-6802-1-ND; Manufacturer Part Number: LQW15AN30NG00D; RoHS: RoHS Compliant; Category: Inductors, Coils, Chokes; Stock 1: 10167; Pricing 1: 1=0.17, 10=0.158, 25=0.1424, 50=0.1236, 100=0.1109, 250=0.10292, 500=0.09502, 750=0.09027, 1000=0.08235 (EUR); Packaging: Cut Tape (CT); Part Status: Active; Inductance: 30nH; Current Rating: 270mA; Current - Saturation: -; Ratings: -; Operating Temperature: -55°C ~ 125°C; Mounting Type: Surface Mount; Package / Case: 0402 (1005 Metric); Supplier Device Package: 0402 (1005 Metric); Size / Dimension: 0.039" L x 0.020" W (1.00mm x 0.50mm); Height - Seated (Max): 0.024" (0.60mm); ComponentLink1URL: http://search.murata.co.jp/Ceramy/image/img/PDF/ENG/L0075S0080LQW15A_00.pdf; ComponentLink1Description: http://search.murata.co.jp/Ceramy/image/img/PDF/ENG/L0075S0080LQW15A_00.pdf
L3 L4 = LQW15AN30NG00D: FIXED IND 30NH 270MA 580 MOHM; Manufacturer: Murata Electronics North America; Type: Wirewound; Material - Core: Non-Magnetic; Tolerance: ±2%; Shielding: Unshielded; DC Resistance (DCR): 580 mOhm Max; Q @ Freq: 25 @ 250MHz; Frequency - Self Resonant: 3.3GHz; Frequency - Test: 100MHz; Exact Component Match: no; Supplier 1: Digi-Key; Supplier Part Number 1: 490-6802-1-ND; Manufacturer Part Number: LQW15AN30NG00D; RoHS: RoHS Compliant; Category: Inductors, Coils, Chokes; Stock 1: 10167; Pricing 1: 1=0.17, 10=0.158, 25=0.1424, 50=0.1236, 100=0.1109, 250=0.10292, 500=0.09502, 750=0.09027, 1000=0.08235 (EUR); Packaging: Cut Tape (CT); Part Status: Active; Inductance: 30nH; Current Rating: 270mA; Current - Saturation: -; Ratings: -; Operating Temperature: -55°C ~ 125°C; Mounting Type: Surface Mount; Package / Case: 0402 (1005 Metric); Supplier Device Package: 0402 (1005 Metric); Size / Dimension: 0.039" L x 0.020" W (1.00mm x 0.50mm); Height - Seated (Max): 0.024" (0.60mm); ComponentLink1URL: http://search.murata.co.jp/Ceramy/image/img/PDF/ENG/L0075S0080LQW15A_00.pdf; ComponentLink1Description: http://search.murata.co.jp/Ceramy/image/img/PDF/ENG/L0075S0080LQW15A_00.pdf
L10 L15 = LQW15AN3N6C10D: FIXED IND 3.6NH 900MA 40 MOHM; Manufacturer: Murata Electronics North America; Type: Wirewound; Material - Core: Non-Magnetic; Tolerance: ±0.2nH; Shielding: Unshielded; DC Resistance (DCR): 40 mOhm Max; Q @ Freq: 30 @ 250MHz; Frequency - Self Resonant: 9.5GHz; Frequency - Test: 100MHz; Exact Component Match: yes; Supplier 1: Digi-Key; Supplier Part Number 1: 490-6811-1-ND; Manufacturer Part Number: LQW15AN3N6C10D; RoHS: RoHS Compliant; Category: Inductors, Coils, Chokes; Stock 1: 13387; Pricing 1: 1=0.19, 10=0.173, 25=0.1556, 50=0.1348, 100=0.1209, 250=0.11228, 500=0.10366, 750=0.09848, 1000=0.08984 (EUR); Packaging: Cut Tape (CT); Part Status: Active; Inductance: 3.6nH; Current Rating: 900mA; Current - Saturation: -; Ratings: -; Operating Temperature: -55°C ~ 125°C; Mounting Type: Surface Mount; Package / Case: 0402 (1005 Metric); Supplier Device Package: 0402 (1005 Metric); Size / Dimension: 0.039" L x 0.020" W (1.00mm x 0.50mm); Height - Seated (Max): 0.024" (0.60mm); ComponentLink1URL: http://search.murata.co.jp/Ceramy/image/img/PDF/ENG/L0075S0080LQW15A_10.pdf; ComponentLink1Description: http://search.murata.co.jp/Ceramy/image/img/PDF/ENG/L0075S0080LQW15A_10.pdf
R33 = ERJ-2GEJ153X: RES SMD 15K OHM 5% 1/10W 0402; Manufacturer: Panasonic Electronic Components; Power (Watts): 0.1W, 1/10W; Temperature Coefficient: ±200ppm/°C; Exact Component Match: no; Supplier 1: Digi-Key; Supplier Part Number 1: P15KJCT-ND; Manufacturer Part Number: ERJ-2GEJ153X; RoHS: RoHS Compliant; Category: Resistors; Stock 1: 371088; Pricing 1: 1=0.09, 50=0.0096, 100=0.007, 250=0.00536, 500=0.00428, 1000=0.00315, 5000=0.00226 (EUR); Packaging: Cut Tape (CT); Part Status: Active; Resistance (Ohms): 15k; Tolerance: ±5%; Composition: Thick Film; Features: Automotive AEC-Q200; Operating Temperature: -55°C ~ 155°C; Package / Case: 0402 (1005 Metric); Supplier Device Package: 0402; Size / Dimension: 0.039" L x 0.020" W (1.00mm x 0.50mm); Height: 0.016" (0.40mm); Number of Terminations: 2; Failure Rate: -; ComponentLink1URL: http://industrial.panasonic.com/www-cgi/jvcr13pz.cgi?E+PZ+3+AOA0001+ERJ2GEJ153X+7+WW; ComponentLink1Description: http://industrial.panasonic.com/www-cgi/jvcr13pz.cgi?E+PZ+3+AOA0001+ERJ2GEJ153X+7+WW; Manufacturer 1: Panasonic Electronic Components; Manufacturer Part Number 1: ERJ-2GEJ153X
R54 R55 = RC0402JR-070RL: RES SMD 0.0OHM JUMPER 1/16W 0402; Manufacturer: Yageo; Resistance (Ohms): 0.0; Power (Watts): 0.063W, 1/16W; Exact Component Match: no; Supplier 1: Digi-Key; Supplier Part Number 1: 311-0.0JRDKR-ND; Manufacturer Part Number: RC0402JR-070RL; RoHS: RoHS Compliant; Category: Resistors; Stock 1: 13423202; Pricing 1: 1=0.09, 10=0.012, 25=0.0084, 100=0.0048, 250=0.0036, 500=0.00288, 1000=0.00212, 2500=0.00184, 5000=0.00152 (EUR); Packaging: Digi-Reel®; Part Status: Active; Tolerance: Jumper; Composition: Thick Film; Features: Moisture Resistant; Temperature Coefficient: -; Operating Temperature: -55°C ~ 155°C; Package / Case: 0402 (1005 Metric); Supplier Device Package: 0402; Size / Dimension: 0.039" L x 0.020" W (1.00mm x 0.50mm); Height - Seated (Max): 0.016" (0.40mm); Number of Terminations: 2; Failure Rate: -; ComponentLink1URL: http://www.yageo.com/NewPortal/yageodocoutput?fileName=/pdf/R-Chip/PYu-RC_Group_51_RoHS_L_4.pdf; ComponentLink1Description: http://www.yageo.com/NewPortal/yageodocoutput?fileName=/pdf/R-Chip/PYu-RC_Group_51_RoHS_L_4.pdf; Manufacturer 1: Yageo; Manufacturer Part Number 1: RC0402JR-070RL
T3 = 1:1 BALUN 900MHZ - 0900BL15C050: 1:1 BALUN- 900MHZ 50/50 Ohm; Manufacturer: Johanson Technology Inc; Manufacturer Part Number: 0900BL15C050E; Component_Description: BALUN GSM/DCS/PCS/CDMA 900MHZ; Frequency Range: 800 ~ 1000MHz; Phase Difference: 180° ±10; Insertion Loss (Max): 1.2dB; Return Loss (Min): 9.5dB; Exact Component Match: no; Supplier 1: Digi-Key; Supplier Part Number 1: 712-1022-1-ND; RoHS: RoHS Compliant; Category: RF/IF and RFID; Stock 1: 0; Pricing 1: 1=0.8, 10=0.672, 25=0.5584, 100=0.4568, 250=0.39336, 500=0.36796, 1000=0.29184 (EUR); Impedance - Unbalanced/Balanced: 50 / 50 Ohm; Package / Case: 0805 (2012 Metric); Mounting Type: Surface Mount; Packaging: Cut Tape (CT); ComponentLink1URL: http://www.johansontechnology.com/images/stories/ip/baluns/JTI_Balun-0900BL15C050_2005-06.pdf; ComponentLink1Description: http://www.johansontechnology.com/images/stories/ip/baluns/JTI_Balun-0900BL15C050_2005-06.pdf
T5 = BD0810J50100AHF: XFRMR BALUN RF 800-1000MHZ 0805; Manufacturer: Anaren; Frequency Range: 800MHz ~ 1GHz; Impedance - Unbalanced/Balanced: 50 / 100 Ohm; Phase Difference: 1°; Insertion Loss (Max): 0.95dB; Return Loss (Min): 13dB; Exact Component Match: no; Supplier Part Number 1: 1173-1056-2-ND; Supplier Part Number 2: 1173-1056-1-ND; Manufacturer Part Number: BD0810J50100AHF; RoHS: RoHS Compliant; Category: RF/IF and RFID; Stock: 9830; Pricing: 1=0.6, 10=0.587, 25=0.3928, 50=0.3494, 100=0.3201, 250=0.28724, 500=0.28124 (EUR); Packaging: Cut Tape (CT); Part Status: Active; Package / Case: 0805 (2012 Metric); Mounting Type: Surface Mount; ComponentLink1URL: https://cdn.anaren.com/product-documents/Xinger/BalunTransformers/BD0810J50100AHF/BD0810J50100AHF_DataSheet(Rev_E).pdf; ComponentLink1Description: https://cdn.anaren.com/product-documents/Xinger/BalunTransformers/BD0810J50100AHF/BD0810J50100AHF_DataSheet(Rev_E).pdf; Supplier 1: Digi-Key
U4 = TXETDCSANF-20.000000: OSC TCXO 20.0000MHZ CLP SW SMD; Manufacturer: Taitien; Output: Clipped Sine Wave; Voltage - Supply: 2.8 V ~ 3.3 V; Frequency Stability: ±2.5ppm; Current - Supply (Max): 2mA; Supplier 1: Digi-Key; Manufacturer Part Number: TXETDCSANF-20.000000; RoHS: RoHS Compliant; Category: Crystals, Oscillators, Resonators; Stock: 500; Pricing 1: 1=1.98, 10=1.932, 50=1.8404, 100=1.6104, 500=1.5644 (EUR); Packaging: Cut Tape (CT); Part Status: Active; Type: TCXO; Function: -; Operating Temperature: -20°C ~ 70°C; Ratings: -; Mounting Type: Surface Mount; Package / Case: 4-SMD, No Lead; Size / Dimension: 0.126" L x 0.098" W (3.20mm x 2.50mm); Height - Seated (Max): 0.039" (1.00mm); Current - Supply (Disable) (Max): -; ComponentLink1URL: http://www.taitien.com/wp-content/uploads/2015/12/XO-0076_TX.pdf; ComponentLink1Description: http://www.taitien.com/wp-content/uploads/2015/12/XO-0076_TX.pdf; Supplier Part Number 1: 1664-1275-1-ND
U5 = ST25RU3993: UHF EPC CLASS1 GEN2 READER; Manufacturer: ST Microelectronics; Manufacturer Part Number: ST25RU3993-BQFT; Frequency: 860MHz ~ 960MHz; Standards: EPC, ISO 18000-6; Voltage - Supply: 2.7 V ~ 3.6 V; Exact Component Match: yes; Supplier 1: Digi-Key; Supplier Part Number 1: AS3993-BQFTTR-ND; RoHS: RoHS Compliant; Category: RF/IF and RFID; Stock 1: 0; Pricing 1: 500=40.10842 (EUR); Packaging: Tape & Reel (TR); Part Status: Active; Type: RFID Reader; Interface: -; Operating Temperature: -; Package / Case: 48-VFQFN Exposed Pad; Supplier Device Package: 48-QFN (7x7); ComponentLink1URL: http://www.ams.com/eng/content/view/download/78518; ComponentLink1Description: http://www.ams.com/eng/content/view/download/78518
X3 = NX3225SA-20.000000MHZ-B2: CRYSTAL 20.0000MHZ 7.2PF SMD; Manufacturer: NDK; Frequency: 20MHz; Frequency Stability: ±15ppm; Frequency Tolerance: ±10ppm; ESR (Equivalent Series Resistance): 80 Ohm; Operating Mode: Fundamental; Exact Component Match: no; Supplier 1: Digi-Key; Supplier Part Number 1: 644-1098-1-ND; Manufacturer Part Number: NX3225SA-20.000000MHZ-B2; RoHS: RoHS Compliant; Category: Crystals, Oscillators, Resonators; Stock 1: 1453; Pricing 1: 1=0.88, 10=0.779, 50=0.7286, 100=0.6439, 500=0.61002, 1000=0.50836 (EUR); Packaging: Cut Tape (CT); Part Status: Active; Type: MHz Crystal; Load Capacitance: 7.2pF; Operating Temperature: -30°C ~ 85°C; Ratings: -; Mounting Type: Surface Mount; Package / Case: 4-SMD, No Lead; Size / Dimension: 0.126" L x 0.098" W (3.20mm x 2.50mm); Height - Seated (Max): 0.028" (0.70mm); ComponentLink1URL: http://media.digikey.com/pdf/Data%20Sheets/NDK%20PDFs/NX3225SA-20.000000MHz-B2.pdf; ComponentLink1Description: http://media.digikey.com/pdf/Data%20Sheets/NDK%20PDFs/NX3225SA-20.000000MHz-B2.pdf